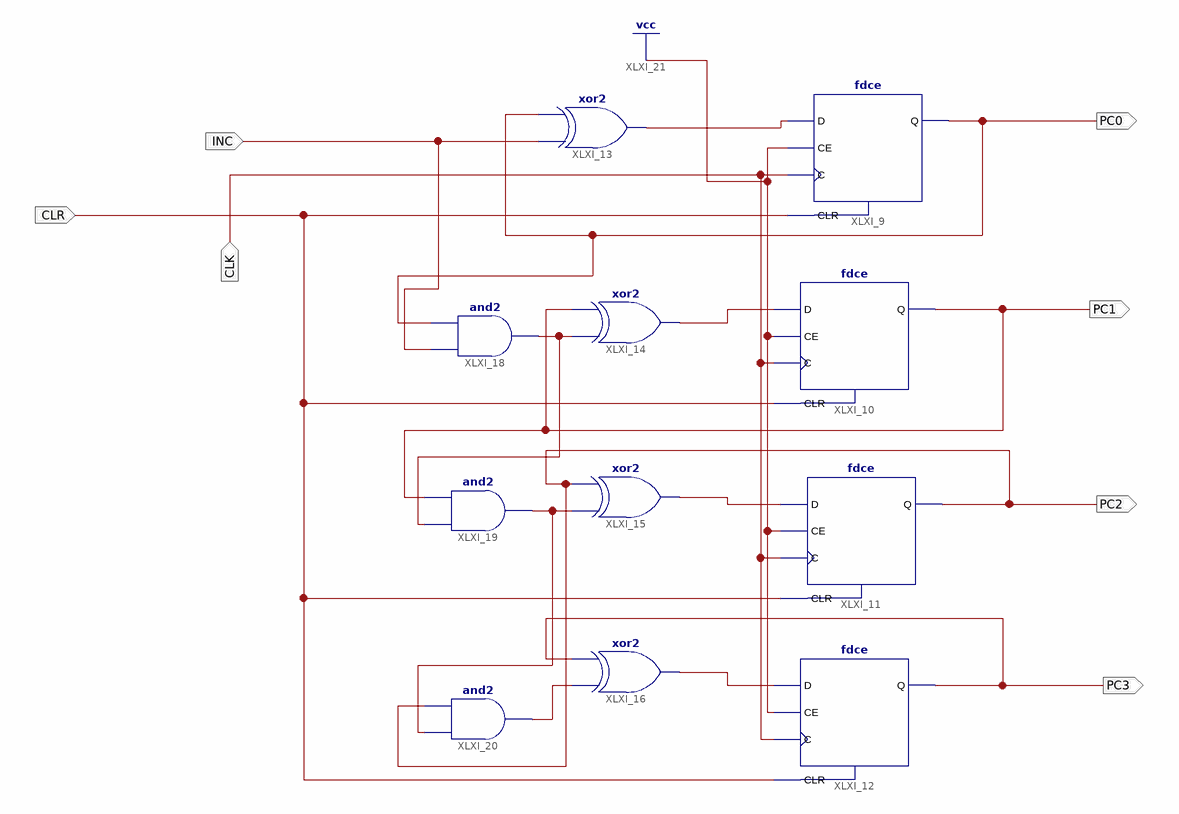
[diagram p0: schematic sheet 1]
// Xilinx ISE schematic counter.sch (spartan3e) as structural Verilog: 11 symbols, 7 ports
module counter (
  input  INC,
  input  CLK,
  input  CLR,
  output PC0,
  output PC1,
  output PC3,
  output PC2
);

  wire XLXN_7, XLXN_8, XLXN_9, XLXN_10, XLXN_12, XLXN_30, XLXN_33;

  fdce XLXI_9 (.C(CLK), .CE(1'b1), .CLR(CLR), .D(XLXN_7), .Q(PC0));
  fdce XLXI_10 (.C(CLK), .CE(1'b1), .CLR(CLR), .D(XLXN_12), .Q(PC1));
  fdce XLXI_11 (.C(CLK), .CE(1'b1), .CLR(CLR), .D(XLXN_10), .Q(PC2));
  fdce XLXI_12 (.C(CLK), .CE(1'b1), .CLR(CLR), .D(XLXN_9), .Q(PC3));
  xor XLXI_13 (XLXN_7, INC, PC0);
  xor XLXI_14 (XLXN_12, XLXN_30, PC1);
  xor XLXI_15 (XLXN_10, XLXN_33, PC2);
  xor XLXI_16 (XLXN_9, XLXN_8, PC3);
  and XLXI_18 (XLXN_30, INC, PC0);
  and XLXI_19 (XLXN_33, XLXN_30, PC1);
  and XLXI_20 (XLXN_8, XLXN_33, PC2);
endmodule
